# EAGLE design PCB_0009 (EAGLE 9.6.2)
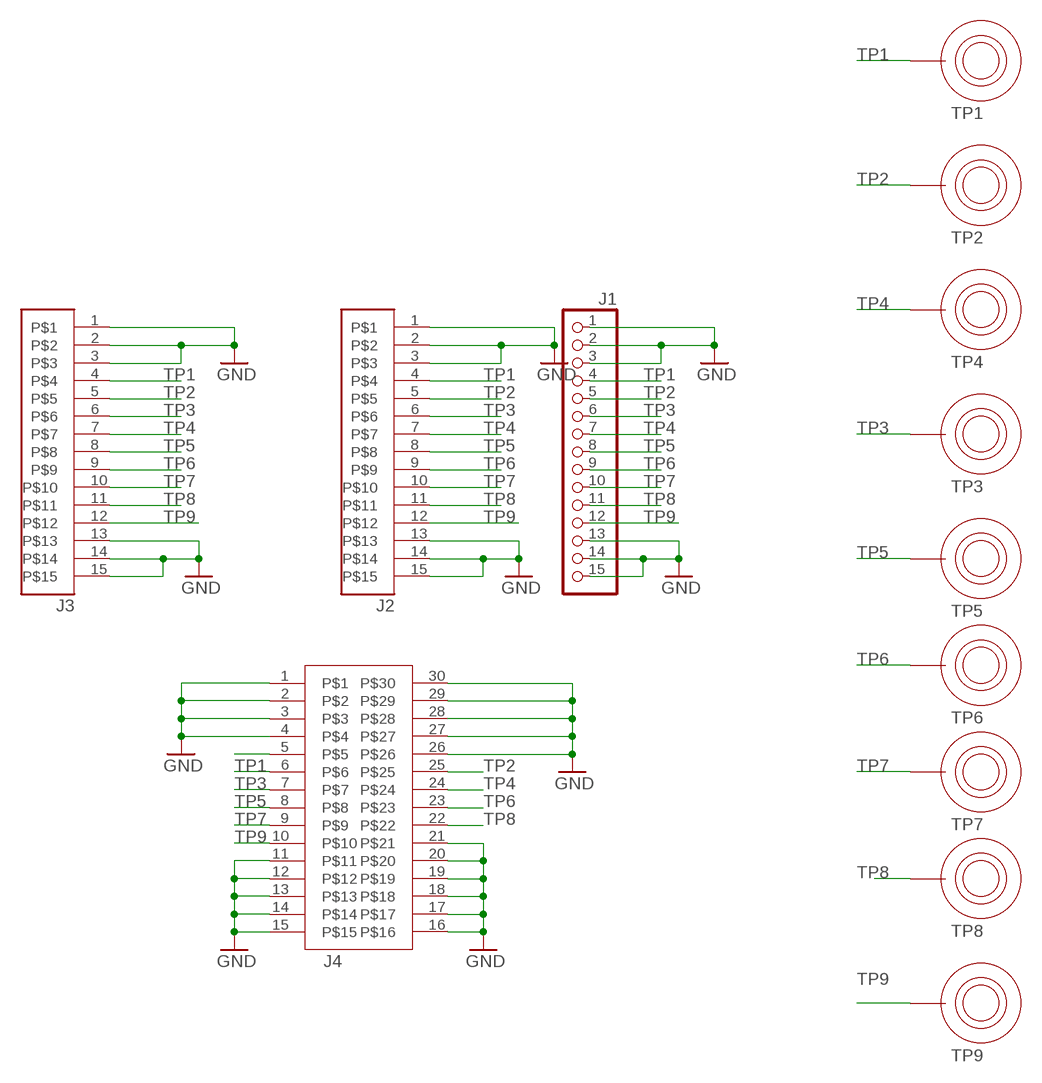
[diagram p0: schematic, sheet 1]

## Parts
J1  PINHD-1X15  [1X15]
J2  HEADER_15X1RA_SMT_HACK  [HEADER_1X15_RA_SMT_HACK]
J3  HEADER_15X1SMT  [HDRV_SMD_15S736P254_1X15_3860X508X965]
J4  HEADER_15X2SMT  [HDRV_SMD_30S736P254_2X15_3860X508X965]
TP1  TOUCHPADROUND15MM  [TOUCHPAD_ROUND_15MM]
TP2  TOUCHPADROUND15MM  [TOUCHPAD_ROUND_15MM]
TP3  TOUCHPADROUND15MM  [TOUCHPAD_ROUND_15MM]
TP4  TOUCHPADROUND15MM  [TOUCHPAD_ROUND_15MM]
TP5  TOUCHPADROUND15MM  [TOUCHPAD_ROUND_15MM]
TP6  TOUCHPADROUND15MM  [TOUCHPAD_ROUND_15MM]
TP7  TOUCHPADROUND15MM  [TOUCHPAD_ROUND_15MM]
TP8  TOUCHPADROUND15MM  [TOUCHPAD_ROUND_15MM]
TP9  TOUCHPADROUND15MM  [TOUCHPAD_ROUND_15MM]

## Nets
GND: J1.1 J1.2 J1.3 J1.13 J1.14 J1.15 J2.1 J2.2 J2.3 J2.13 J2.14 J2.15 J3.1 J3.2 J3.3 J3.13 J3.14 J3.15 J4.1 J4.2 J4.3 J4.4 J4.11 J4.12 J4.13 J4.14 J4.15 J4.16 J4.17 J4.18 J4.19 J4.20 J4.21 J4.26 J4.27 J4.28 J4.29 J4.30
N$3: J4.5
TP1: J1.4 J2.4 J3.4 J4.6 TP1.P$1
TP2: J1.5 J2.5 J3.5 J4.25 TP2.P$1
TP3: J1.6 J2.6 J3.6 J4.7 TP3.P$1
TP4: J1.7 J2.7 J3.7 J4.24 TP4.P$1
TP5: J1.8 J2.8 J3.8 J4.8 TP5.P$1
TP6: J1.9 J2.9 J3.9 J4.23 TP6.P$1
TP7: J1.10 J2.10 J3.10 J4.9 TP7.P$1
TP8: J1.11 J2.11 J3.11 J4.22 TP8.P$1
TP9: J1.12 J2.12 J3.12 J4.10 TP9.P$1

## Library data of the parts
J1 = pinhead:PINHD-1X15: PIN HEADER
J2 J3 = SerialWombat_F360_Library:HEADER_15X1
J4 = SerialWombat_F360_Library:HEADER_15X2
TP1-TP9 = SerialWombat_F360_Library:TOUCHPAD

## Board
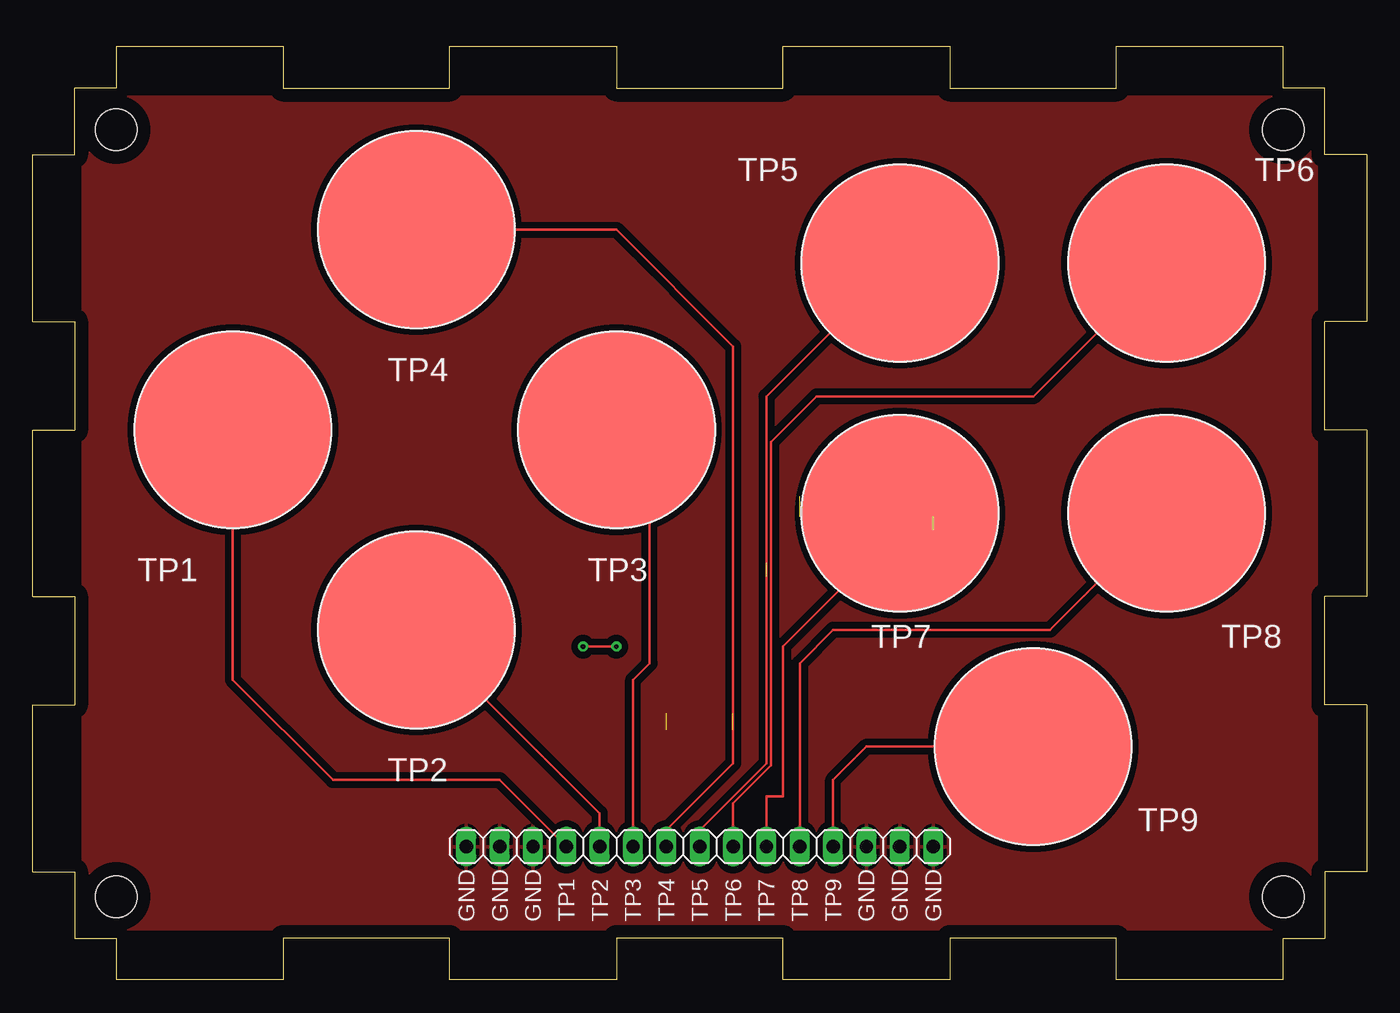
[diagram p1: board, top side]
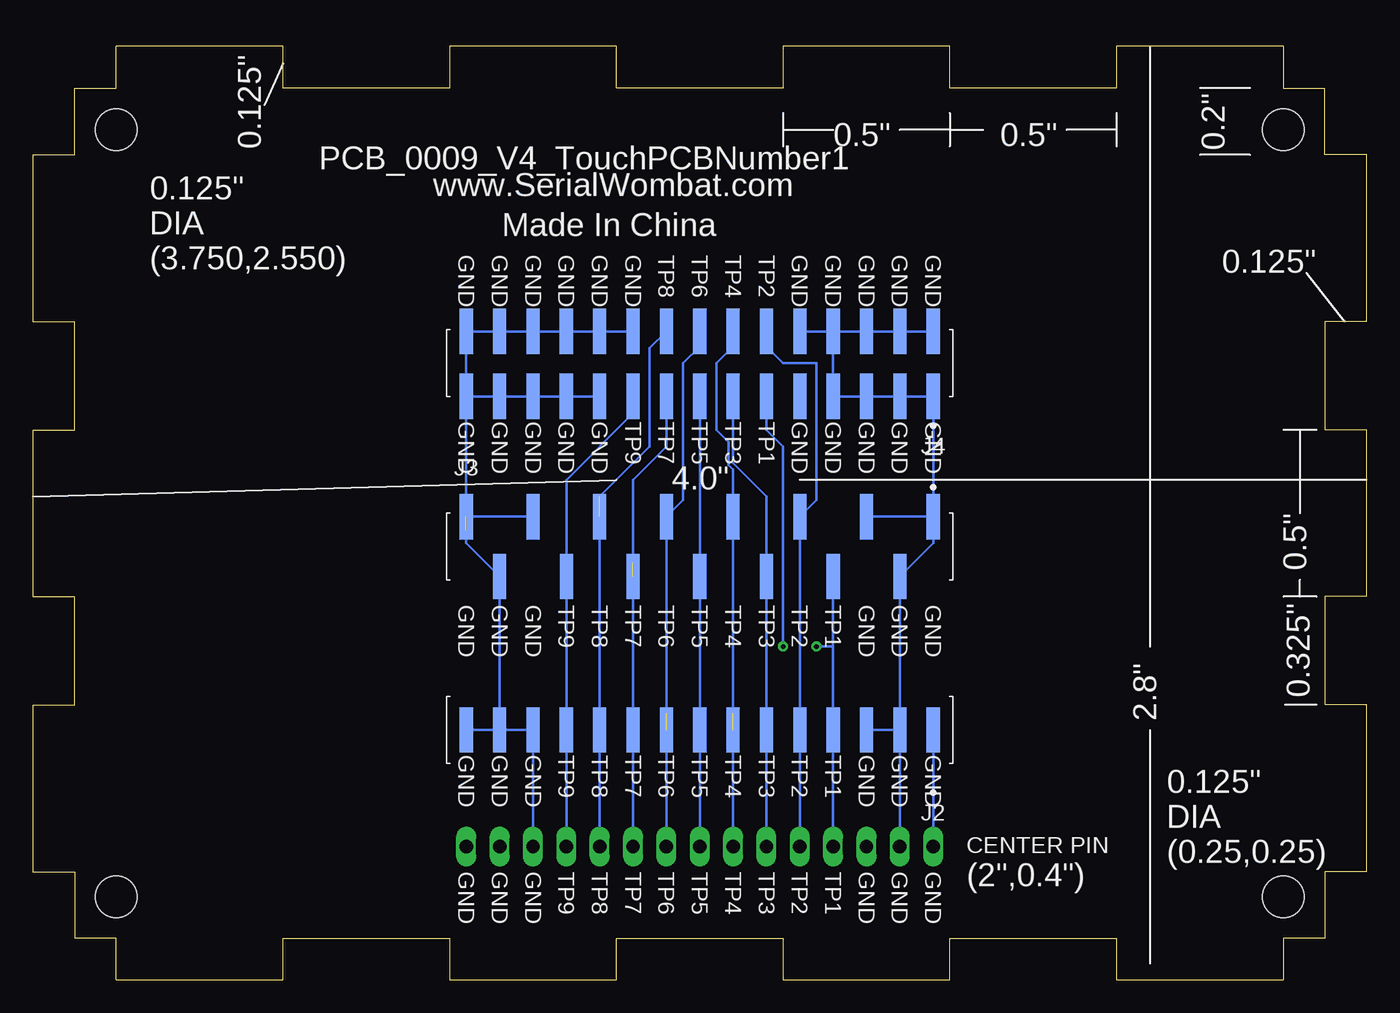
[diagram p2: board, bottom side, seen from below]

Size 101.6 x 71.12 mm. Coordinates in mm from the lower left corner, seen from the top.
Outline: 6.35,71.12 19.05,71.12 19.05,67.94 31.75,67.94 31.75,71.12 44.45,71.12 44.45,67.94 57.15,67.94 57.15,71.12 69.85,71.12 69.85,67.94 82.55,67.94 82.55,71.12 95.25,71.12 95.25,67.94 98.42,67.94 98.42,62.87 101.6,62.87 101.6,50.16 98.42,50.16 98.42,41.91 101.6,41.91 101.6,29.21 98.42,29.21 98.42,20.95 101.6,20.95 101.6,8.26 98.42,8.26 98.42,3.17 95.25,3.17 95.25,0 82.55,0 82.55,3.17 69.85,3.17 69.85,0 57.15,0 57.15,3.17 44.45,3.17 44.45,0 31.75,0 31.75,3.17 19.05,3.17 19.05,0 6.35,0 6.35,3.17 3.17,3.17 3.17,8.26 0,8.26 0,20.95 3.17,20.95 3.17,29.21 0,29.21 0,41.91 3.17,41.91 3.17,50.16 0,50.16 0,62.87 3.17,62.87 3.17,67.94 6.35,67.94 6.35,71.12
Copper layers (1*16): Top 0.035mm / dielectric 1.5mm / Bottom 0.035mm
Design rules "default *": minimum track width 6mil, minimum drill 0.35mm, track to track 6mil, track to pad 6mil, pad to pad 6mil, via to via 6mil, smd to smd 6mil, copper to edge 40mil, drill to drill 6mil, minimum pad ring 10mil, minimum via ring 8mil, stop-mask expansion 4mil, vias tented up to drill 0mil, thermal gap 10mil
Holes 3.17 mm at 6.35,64.77 6.35,6.35 95.25,6.35 95.25,64.77

### Footprints (pad centres in the part's own frame; a part is rotated, then mirrored left to right if it is on the bottom)
1X15 = drill 1.016 long: 1 -17.78,0; 2 -15.24,0; 3 -12.7,0; 4 -10.16,0; 5 -7.62,0; 6 -5.08,0; 7 -2.54,0; 8 0,0; 9 2.54,0; 10 5.08,0; 11 7.62,0; 12 10.16,0; 13 12.7,0; 14 15.24,0; 15 17.78,0
HEADER_1X15_RA_SMT_HACK = smd 1 x 3.45: 1 0,-1.275; 2 2.54,-1.275; 3 5.08,-1.275; 4 7.62,-1.275; 5 10.16,-1.275; 6 12.7,-1.275; 7 15.24,-1.275; 8 17.78,-1.275; 9 20.32,-1.275; 10 22.86,-1.275; 11 25.4,-1.275; 12 27.94,-1.275; 13 30.48,-1.275; 14 33.02,-1.275; 15 35.56,-1.275
HDRV_SMD_15S736P254_1X15_3860X508X965 = smd 1 x 3.45: 1 35.56,2.275; 2 33.02,-2.275; 3 30.48,2.275; 4 27.94,-2.275; 5 25.4,2.275; 6 22.86,-2.275; 7 20.32,2.275; 8 17.78,-2.275; 9 15.24,2.275; 10 12.7,-2.275; 11 10.16,2.275; 12 7.62,-2.275; 13 5.08,2.275; 14 2.54,-2.275; 15 0,2.275
HDRV_SMD_30S736P254_2X15_3860X508X965 = smd 1 x 3.45: 1 0,1.265; 2 2.54,1.265; 3 5.08,1.265; 4 7.62,1.265; 5 10.16,1.265; 6 12.7,1.265; 7 15.24,1.265; 8 17.78,1.265; 9 20.32,1.265; 10 22.86,1.265; 11 25.4,1.265; 12 27.94,1.265; 13 30.48,1.265; 14 33.02,1.265; 15 35.56,1.265; 16 35.56,-3.685; 17 33.02,-3.685; 18 30.48,-3.685; 19 27.94,-3.685; 20 25.4,-3.685; 21 22.86,-3.685; 22 20.32,-3.685; 23 17.78,-3.685; 24 15.24,-3.685; 25 12.7,-3.685; 26 10.16,-3.685; 27 7.62,-3.685; 28 5.08,-3.685; 29 2.54,-3.685; 30 0,-3.685
TOUCHPAD_ROUND_15MM = smd 15.011 x 15.011: P$1 0,0

### Placement (x,y rotation side)
J1  50.8,10.16 0 top
J2  33.02,17.78 180 bottom
J3  68.58,33.02 0 bottom
J4  33.02,45.72 180 bottom
TP1  15.24,41.91 0 top
TP2  29.21,26.67 0 top
TP3  44.45,41.91 0 top
TP4  29.21,57.15 0 top
TP5  66.04,54.61 0 top
TP6  86.36,54.61 0 top
TP7  66.04,35.56 0 top
TP8  86.36,35.56 0 top
TP9  76.2,17.78 0 top

### Tracks (layer width: path | path; a pad name or v marks a point on that pad's centre or on a via)
GND  (1 unrouted)
  Bottom 0.203: J4.27 J4.4 J4.3 J4.2 J4.1 J3.1 | J4.27 J4.28 J4.29 J4.30 | J4.21 J4.20 J4.19 J4.18 J4.17 J4.16 J4.15 | J4.15 J4.14 J4.13 J4.12 J4.11 | J4.27 J4.26 | J3.13 J3.15 J4.15 | 68.58,34.29 68.58,33.28 J3.14 J2.14 | J3.1 33.02,33.28 J3.2 J2.2 | J1.1 J2.1 | J1.2 J2.2 | J1.13 J2.13 J2.14 | J2.14 J2.15 | J2.2 J2.3 | J3.1 J3.3
  pour Top (isolate 0.508): 3.81,67.31 97.79,67.31 97.79,3.81 3.81,3.81
TP1  (via drill 0.35)
  Top 0.203: v41.91,25.4 v44.45,25.4 | TP1.P$1 15.24,22.86 22.86,15.24 35.56,15.24 J1.4
  Bottom 0.203: J1.4 J2.4 40.64,25.4 | J3.4 40.64,25.4 | 40.64,25.4 v41.91,25.4 | v44.45,25.4 44.45,40.64 45.72,41.91 45.72,43.18 J4.6
TP2
  Top 0.203: TP2.P$1 43.18,12.7 J1.5
  Bottom 0.203: J1.5 J2.5 J3.5 41.91,36.56 41.91,46.99 44.45,46.99 45.72,48.26 J4.25
TP3
  Top 0.203: J1.6 45.72,22.86 46.99,24.13 46.99,39.37 TP3.P$1
  Bottom 0.203: J4.7 48.26,39.37 45.72,36.83 J3.6 J2.6 J1.6
TP4  (1 unrouted)
  Top 0.203: TP4.P$1 44.45,57.15 53.34,48.26 53.34,16.51 48.26,11.43 J1.7
  Bottom 0.203: 48.26,20.32 J3.7 48.26,38.87 48.62,39.22 48.62,41 49.53,41.91 49.53,46.99 48.26,48.26 J4.24 | J2.7 J1.7
TP5
  Top 0.203: TP5.P$1 55.88,44.45 55.88,16.51 50.8,11.43 J1.8
  Bottom 0.203: J1.8 J2.8 J3.8 50.8,41.91 50.8,43.18 J4.8
TP6  (1 unrouted)
  Top 0.203: TP6.P$1 76.2,44.45 59.69,44.45 56.24,41 56.24,16.36 53.34,13.47 J1.9
  Bottom 0.203: 53.34,20.32 J3.9 52.07,36.56 52.07,46.99 50.8,48.26 J4.23 | J2.9 J1.9
TP7  (1 unrouted)
  Top 0.203: TP7.P$1 66.04,34.29 57.15,25.4 57.15,13.97 55.88,13.97 J1.10
  Bottom 0.203: J3.10 J2.10 J1.10 | 55.88,31.75 55.88,38.1 53.34,40.64 J4.9
TP8  (1 unrouted)
  Top 0.203: TP8.P$1 77.47,26.67 60.96,26.67 58.42,24.13 J1.11
  Bottom 0.203: J4.22 54.61,48.13 54.61,40.64 58.42,36.83 | J3.11 J2.11 J1.11
TP9
  Top 0.203: J1.12 60.96,15.24 63.5,17.78 TP9.P$1
  Bottom 0.203: J1.12 J2.12 J3.12 60.96,38.1 55.88,43.18 J4.10

### Text on the board
tPlace: GND / GND / GND / TP1 / TP2 / TP3 / TP4 / TP5 / TP6 / TP7 / TP8 / TP9 / GND / GND / GND
bPlace: 0.125" | 0.2" | 0.5" | PCB_0009_V4_TouchPCBNumber1 | 0.5" | www.SerialWombat.com | Made In China | GND / GND / GND / GND / GND / TP2 / TP4 / TP6 / TP8 / GND / GND / GND / GND / GND / GND | 0.125" | 0.125" / DIA / (3.750,2.550) | GND / GND / GND / GND / GND / TP1 / TP3 / TP5 / TP7 / TP9 / GND / GND / GND / GND / GND | 4.0" | 0.5" | 0.325" | GND / GND / GND / TP1 / TP2 / TP3 / TP4 / TP5 / TP6 / TP7 / TP8 / TP9 / GND / GND / GND | 2.8" | GND / GND / GND / TP1 / TP2 / TP3 / TP4 / TP5 / TP6 / TP7 / TP8 / TP9 / GND / GND / GND | CENTER PIN | 0.125" / DIA / (0.25,0.25) | GND / GND / GND / TP1 / TP2 / TP3 / TP4 / TP5 / TP6 / TP7 / TP8 / TP9 / GND / GND / GND | (2",0.4")